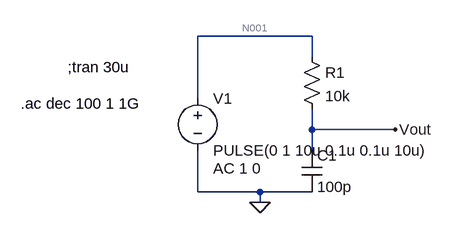
[diagram p0: schematic TestPasseBas.asc]
TestPasseBas.asc, the LTspice schematic file:
Version 4
SHEET 1 880 680
WIRE 176 32 0 32
WIRE 176 64 176 32
WIRE 0 128 0 32
WIRE 176 176 176 144
WIRE 304 176 176 176
WIRE 176 208 176 176
WIRE 0 272 0 208
WIRE 96 272 0 272
WIRE 176 272 96 272
WIRE 96 288 96 272
FLAG 304 176 Vout
FLAG 96 288 0
SYMBOL res 160 48 R0
SYMATTR InstName R1
SYMATTR Value 10k
SYMBOL cap 160 208 R0
SYMATTR InstName C1
SYMATTR Value 100p
SYMBOL voltage 0 112 R0
WINDOW 123 24 124 Left 2
WINDOW 39 0 0 Left 0
SYMATTR InstName V1
SYMATTR Value PULSE(0 1 10u 0.1u 0.1u 10u)
SYMATTR Value2 AC 1 0
TEXT -200 80 Left 2 !;tran 30u
TEXT -272 136 Left 2 !.ac dec 100 1 1G

The netlist it stands for:
* TestPasseBas.asc
R1 N001 Vout 10k
C1 Vout 0 100p
V1 N001 0 PULSE(0 1 10u 0.1u 0.1u 10u) AC 1 0
;tran 30u
.ac dec 100 1 1G
.backanno
.end

* Results of the author's LTspice run, read from the files saved beside the schematic
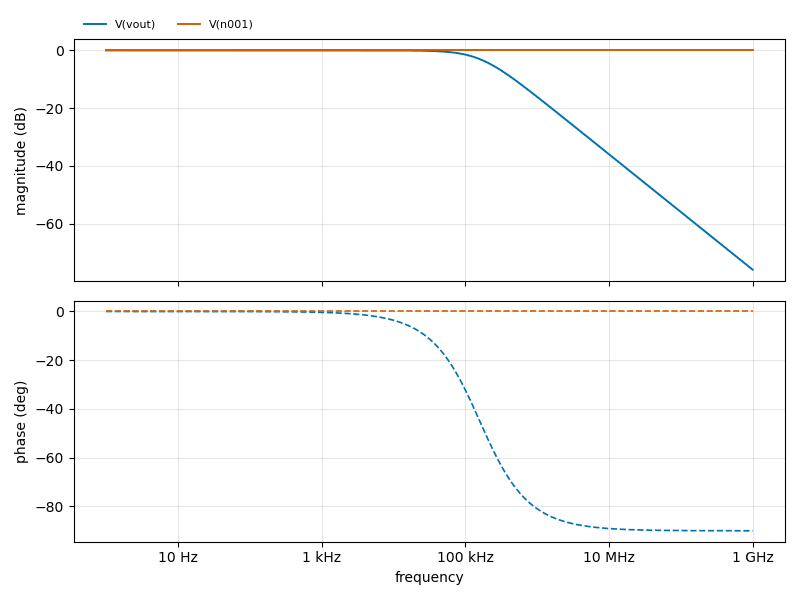
[diagram p1: AC Analysis of TestPasseBas.asc, plotted from the saved traces]
* AC Analysis, 1 run:
*   V(vout): -0.00 dB at 1 Hz, -75.96 dB at 1 GHz, peak -0.00 dB at 1 Hz, 3 dB below the peak at 159.1 kHz
*   V(n001): 0.00 dB at 1 Hz, 0.00 dB at 1 GHz, peak 0.00 dB at 1 Hz